# Altium schematic sheet PLC.SchDoc
size A3
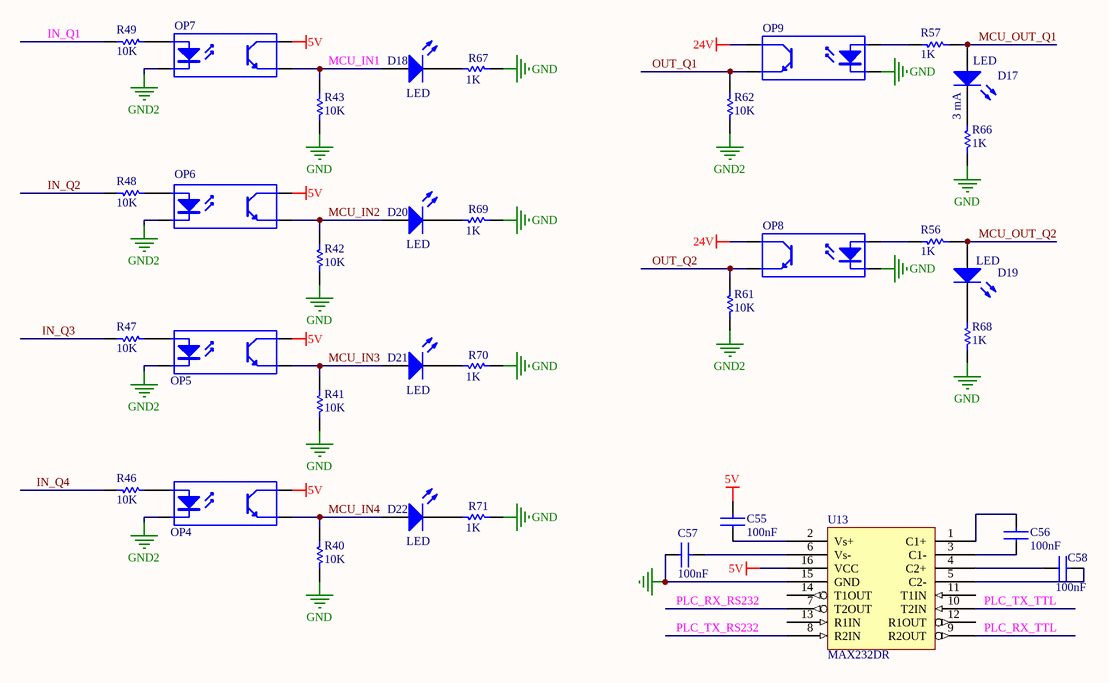
[diagram p0: PLC.SchDoc]

## Parts
C55  100nF  [0805C]
C56  100nF  [0805c]
C57  100nF  [0805c]
C58  100nF  [0805c]
D17  LED  Publisher: 3 mA  [0805D]
D18  LED  [0805D]
D19  LED  [0805D]
D20  LED  [0805D]
D21  LED  [0805D]
D22  LED  [0805D]
OP4  EL817  [EL817]  (value not drawn)
OP5  EL817  [EL817]  (value not drawn)
OP6  EL817  [EL817]  (value not drawn)
OP7  EL817  [EL817]  (value not drawn)
OP8  EL817  [EL817]  (value not drawn)
OP9  EL817  [EL817]  (value not drawn)
R40  10K  [0805]
R41  10K  [0805]
R42  10K  [0805]
R43  10K  [0805]
R46  10K  [0805]
R47  10K  [0805]
R48  10K  [0805]
R49  10K  [0805]
R56  1K  [0805]
R57  1K  [0805]
R61  10K  [0805]
R62  10K  [0805]
R66  1K  [0805]
R67  1K  [0805]
R68  1K  [0805]
R69  1K  [0805]
R70  1K  [0805]
R71  1K  [0805]
U13  MAX232DR  [L16_N]

## Nets
5V: C55.2 OP4.4(C) OP5.4(C) OP6.4(C) OP7.4(C) U13.16(VCC)
24V: OP8.4(C) OP9.4(C)
GND: C57.1 OP8.2(K) OP9.2(K) R40.2 R41.2 R42.2 R43.2 R66.2 R67.2 R68.2 R69.2 R70.2 R71.2 U13.15(GND)
GND2: OP4.2(K) OP5.2(K) OP6.2(K) OP7.2(K) R61.1 R62.1
IN_Q1: R49.1
IN_Q2: R48.1
IN_Q3: R47.1
IN_Q4: R46.1
MCU_IN1: D18.1(A) OP7.3(E) R43.1
MCU_IN2: D20.1(A) OP6.3(E) R42.1
MCU_IN3: D21.1(A) OP5.3(E) R41.1
MCU_IN4: D22.1(A) OP4.3(E) R40.1
MCU_OUT_Q1: D17.1(A) R57.2
MCU_OUT_Q2: D19.1(A) R56.2
OUT_Q1: OP9.3(E) R62.2
OUT_Q2: OP8.3(E) R61.2
PLC_RX_RS232: U13.7(T2OUT)
PLC_RX_TTL: U13.9(R2OUT)
PLC_TX_RS232: U13.8(R2IN)
PLC_TX_TTL: U13.10(T2IN)
NetC55_1: C55.1 U13.2(Vs+)
NetC56_1: C56.1 U13.3(C1-)
NetC56_2: C56.2 U13.1(C1+)
NetC57_2: C57.2 U13.6(Vs-)
NetC58_1: C58.1 U13.4(C2+)
NetC58_2: C58.2 U13.5(C2-)
NetD17_2: D17.2(K) R66.1
NetD18_2: D18.2(K) R67.1
NetD19_2: D19.2(K) R68.1
NetD20_2: D20.2(K) R69.1
NetD21_2: D21.2(K) R70.1
NetD22_2: D22.2(K) R71.1
NetOP4_1: OP4.1(A) R46.2
NetOP5_1: OP5.1(A) R47.2
NetOP6_1: OP6.1(A) R48.2
NetOP7_1: OP7.1(A) R49.2
NetOP8_1: OP8.1(A) R56.1
NetOP9_1: OP9.1(A) R57.1

Not connected (* = marked no-connect by the designer): U13 11(T1IN) 12(R1OUT) 13(R1IN) 14(T1OUT)

## Library data of the parts
C55-C58 = CAP NP: Part Field 1: CS; Section Code: 12103465; Part Field 2: 0603; Part Field 3: 20V
D17-D22 = LED3: Typical BLUE SiC LED; Published: 8-Jun-2000; LatestRevisionDate: 17-Dec-2003; LatestRevisionNote: PCB Footprint replaced.; DatasheetVersion: 16-Apr-2002; PackageVersion: 16-Apr-2002; PackageReference: 3.5X2.8X1.9; PackageDescription: SM LED; 2 C-Bend Leads; Body 3.5 x 2.8 x 1.9 mm, inc leads (LxWxH typ)
  D18-D22: Publisher: Altium Limited
OP4-OP9 = Optoisolator1: 4-Pin Phototransistor Optocoupler
  OP4-OP7 OP9: Published: 24-Mar-1999; LatestRevisionDate: 04-Mar-2005; LatestRevisionNote: Sch pins 3 & 4 Swapped.; DatasheetVersion: Nov-2003; PackageReference: DIP-4; Publisher: Altium Limited
R40-R43 R46-R49 R56 R57 R61 R62 R66-R71 = Res Semi: Semiconductor Resistor; Published: 8-Jun-2000; LatestRevisionDate: 17-Jul-2002; LatestRevisionNote: Re-released for DXP Platform.; PackageReference: AXIAL-0.5; Publisher: Altium Limited; PackageDescription: Axial Device, Thru-Hole; 2 Leads; 0.5 in Pin Spacing
  R40-R43 R46-R49 R61 R62: Value: 10K
  R56 R57 R66-R71: Value: 1K
U13 = MAX232: DUAL EIA-232 DRIVER/RECEIVER; Part Field 1: US; Section Code: 14203714; Part Field 2: SOL-16